# Altium project Arduino Plane Receiver.PrjPCB
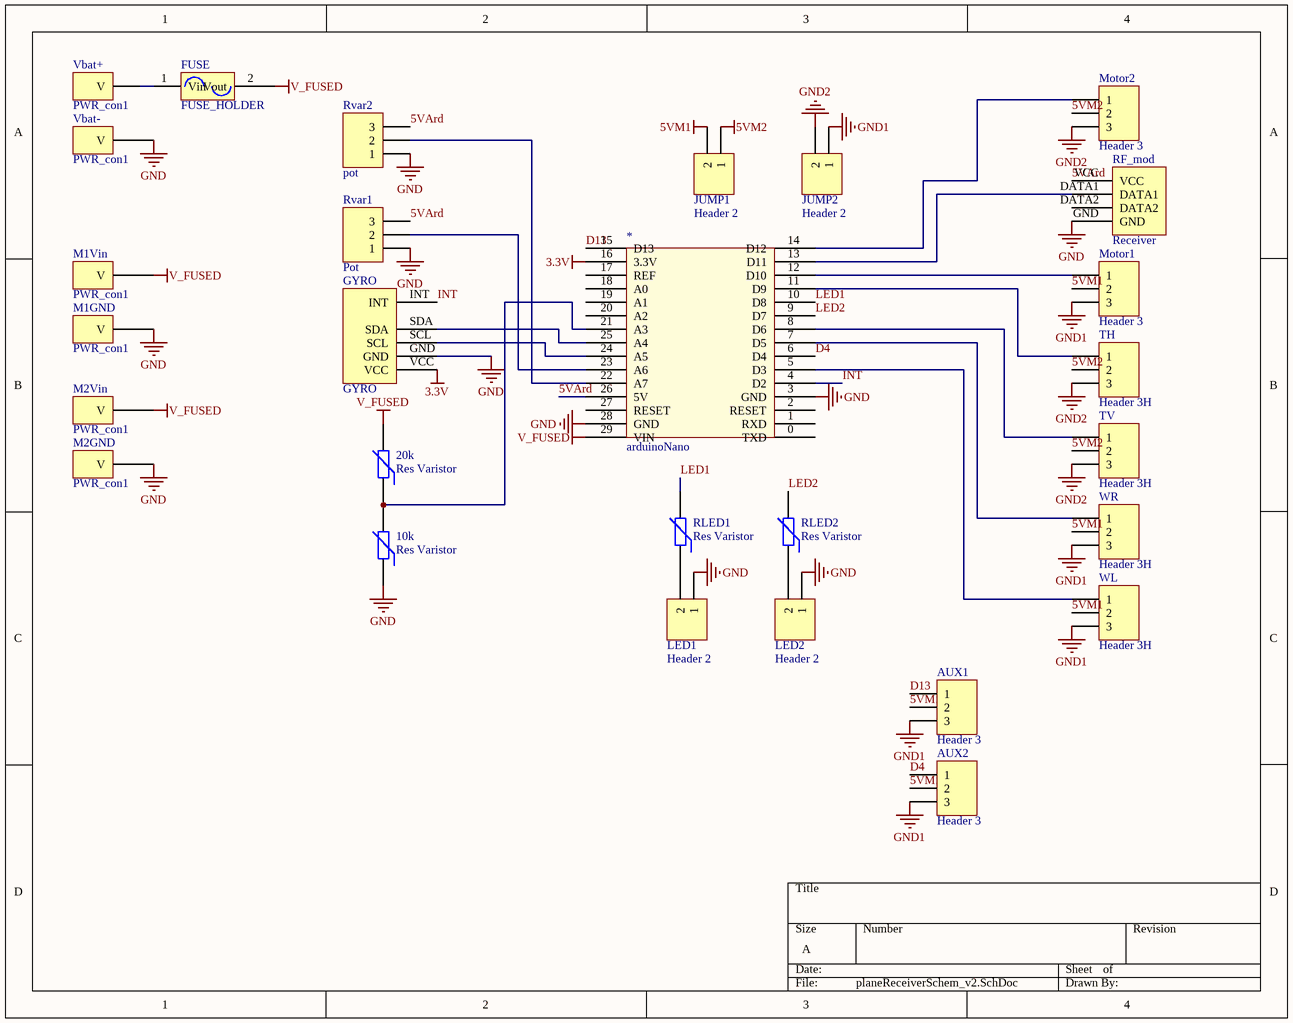
[diagram p0: planeReceiverSchem_v2.SchDoc]
1 sheet, 28 parts. Net scope: global (net labels, ports and power ports of the same name join across sheets).
Board file: Plane_receiver_pcb.PcbDoc

## Sheet planeReceiverSchem_v2.SchDoc
size A

### Parts
10k  Res Varistor  [6-0805_L]
20k  Res Varistor  [6-0805_L]
*  arduinoNano  [Arduino nano]
AUX1  Header 3  [HDR1X3]
AUX2  Header 3  [HDR1X3]
FUSE  FUSE_HOLDER  [FUSE_HOLDER]
GYRO  GYRO  [Gyro]
JUMP1  Header 2  [HDR1X2]
JUMP2  Header 2  [HDR1X2]
LED1  Header 2  [HDR1X2]
LED2  Header 2  [HDR1X2]
M1GND  PWR_con1  [PWR_CON_1]
M1Vin  PWR_con1  [PWR_CON_1]
M2GND  PWR_con1  [PWR_CON_1]
M2Vin  PWR_con1  [PWR_CON_1]
Motor1  Header 3  [HDR1X3]
Motor2  Header 3  [HDR1X3]
RF_mod  Receiver  [RF_modue]
RLED1  Res Varistor  [6-0805_L]
RLED2  Res Varistor  [6-0805_L]
Rvar1  Pot  [HDR1X3]
Rvar2  pot  [HDR1X3]
TH  Header 3H  [HDR1X3H]
TV  Header 3H  [HDR1X3H]
Vbat+  PWR_con1  [PWR_CON_1]
Vbat-  PWR_con1  [PWR_CON_1]
WL  Header 3H  [HDR1X3H]
WR  Header 3H  [HDR1X3H]

### Nets
3.3V: *.16(3.3V) GYRO.VCC
5VM1: AUX1.2 AUX2.2 JUMP1.2 Motor1.2 WL.2 WR.2
5VM2: JUMP1.1 Motor2.2 TH.2 TV.2
GND: 10k.1 *.3(GND) *.28(GND) GYRO.GND LED1.1 LED2.1 M1GND.0(V) M2GND.0(V) RF_mod.GND Rvar1.1 Rvar2.1 Vbat-.0(V)
GND1: AUX1.3 AUX2.3 JUMP2.1 Motor1.3 WL.3 WR.3
GND2: JUMP2.2 Motor2.3 TH.3 TV.3
V_FUSED: 20k.2 *.29(VIN) FUSE.2(Vout) M1Vin.0(V) M2Vin.0(V)
5VArd: *.26(5V) RF_mod.VCC Rvar1.3 Rvar2.3
D4: *.6(D4) AUX2.1
D13: *.15(D13) AUX1.1
INT: *.4(D2) GYRO.INT
LED1: *.10(D8) RLED1.2
LED2: *.9(D7) RLED2.2
Net10k_2: 10k.2 20k.1 *.21(A3)
Net*_5: *.5(D3) WL.1
Net*_7: *.7(D5) WR.1
Net*_8: *.8(D6) TV.1
Net*_11: *.11(D9) TH.1
Net*_12: *.12(D10) Motor1.1
Net*_13: *.13(D11) RF_mod.DATA1
Net*_14: *.14(D12) Motor2.1
Net*_22: *.22(A7) Rvar2.2
Net*_23: *.23(A6) Rvar1.2
Net*_24: *.24(A5) GYRO.SCL
Net*_25: *.25(A4) GYRO.SDA
NetFUSE_1: FUSE.1(Vin) Vbat+.0(V)
NetLED1_2: LED1.2 RLED1.1
NetLED2_2: LED2.2 RLED2.1

Not connected (* = marked no-connect by the designer): * 0(TXD) 1(RXD) 2(RESET) 17(REF) 18(A0) 19(A1) 20(A2) 27(RESET); RF_mod DATA2

### Library data of the parts
10k 20k RLED1 RLED2 = Res Varistor: Varistor (Voltage-Sensitive Resistor); Published: 24-Mar-1999; LatestRevisionDate: 29-May-2009; LatestRevisionNote: IPC-7351 Footprint Added.; PackageVersion: Mar-2003; PackageReference: 6-0805; Publisher: Altium Limited; PackageDescription: Chip Resistor 0805 Case Size; Code_IPC: RESC2012
AUX1 AUX2 Motor1 Motor2 Rvar1 Rvar2 = Header 3: Header, 3-Pin; LatestRevisionDate: 17-Jul-2002; LatestRevisionNote: Re-released for DXP Platform.; Publisher: Altium Limited
JUMP1 JUMP2 LED1 LED2 = Header 2: Header, 2-Pin; LatestRevisionDate: 17-Jul-2002; LatestRevisionNote: Re-released for DXP Platform.; Publisher: Altium Limited
TH TV WL WR = Header 3H: Header, 3-Pin, Right Angle; LatestRevisionDate: 17-Jul-2002; LatestRevisionNote: Re-released for DXP Platform.; Publisher: Altium Limited